# EAGLE schematic open-source-event-marker-photodiode-schematics (EAGLE 9.3.0)
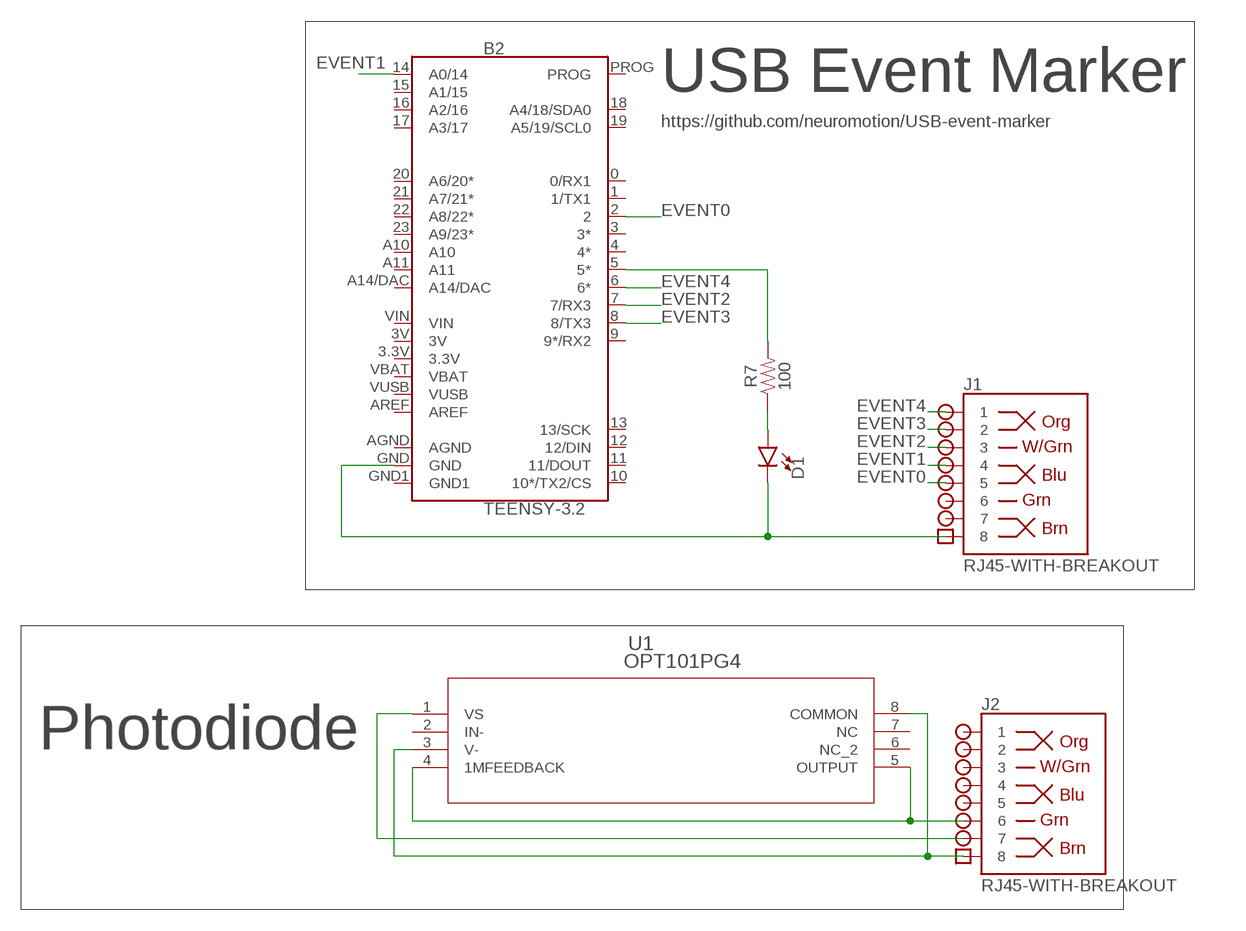
[diagram p0: schematic, sheet 1]

## Parts
B2  TEENSY-3.2  TEENSY-3.1SILK  [TEENSY-3.1]
D1  LED-3MM-NO_SILK  [LED_3MM-NS]
J1  RJ45-WITH-BREAKOUT  [RJ45-WITH-BREAKOUT-PACKAGE]
J2  RJ45-WITH-BREAKOUT  [RJ45-WITH-BREAKOUT-PACKAGE]
R7  100  100OHM-HORIZ-1/4W-1%  [AXIAL-0.3]
U1  OPT101PG4  [NTC8]

## Nets
EVENT0: B2.2 J1.5
EVENT1: B2.14(A0/14) J1.4
EVENT2: B2.7(7/RX3) J1.3
EVENT3: B2.8(8/TX3) J1.2
EVENT4: B2.6(6*) J1.1
N$1: D1.A R7.P$1
N$4: B2.GND D1.K(C) J1.8
N$6: J2.8 U1.3(V-) U1.8(COMMON)
N$7: J2.7 U1.1(VS)
N$8: J2.6 U1.4(1MFEEDBACK) U1.5(OUTPUT)
N$9: B2.5(5*) R7.P$2
Unconnected: B2.0(0/RX1) B2.1(1/TX1) B2.3(3*) B2.4(4*) B2.9(9*/RX2) B2.10(10*/TX2/CS) B2.11(11/DOUT) B2.12(12/DIN) B2.13(13/SCK) B2.15(A1/15) B2.16(A2/16) B2.17(A3/17) B2.18(A4/18/SDA0) B2.19(A5/19/SCL0) B2.20(A6/20*) B2.21(A7/21*) B2.22(A8/22*) B2.23(A9/23*) B2.A10 B2.A11 B2.A14/DAC B2.AREF B2.PROG J1.6 J1.7 J2.1 J2.2 J2.3 J2.4 J2.5 U1.2(IN-) U1.6(NC_2) U1.7(NC)

## Notes on the sheet
- USB Event Marker
- https://github.com/neuromotion/USB-event-marker
- Photodiode

## Power pins joined to a net without a drawn wire
3.3V: B2.3.3V
3V: B2.3V
AGND: B2.AGND
GND1: B2.GND1
VBAT: B2.VBAT
VIN: B2.VIN
VUSB: B2.VUSB

## Library data of the parts
B2 = SparkFun-Boards:TEENSY-3.1: Teensy 3+ Footprint Mechanical footprint with connectors for Teensy Development Board with ARM Cortex. SparkFun Products: Teensy 3.2 <https://www.sparkfun.com/products/13736> Teensy LC <https://www.sparkfun.com/products/13305>; SF_ID: DEV-12646
D1 = SparkFun-LED:LED: LED (Generic) Standard schematic elements and footprints for 5mm, 3mm, 1206, and 0603 sized LEDs. Generic LEDs with no color specified.
J1 J2 = matteson-parts:RJ45-WITH-BREAKOUT
R7 = SparkFun-Resistors:100OHM: 100Ω resistor A resistor is a passive two-terminal electrical component that implements electrical resistance as a circuit element. Resistors act to reduce current flow, and, at the same time, act to lower voltage levels within circuits. - Wikipedia; PROD_ID: RES-12181
U1 = matteson-parts:OPT101PG4; MANUFACTURER_PART_NUMBER: OPT101PG4; VENDOR: Texas Instruments